# EAGLE design board (EAGLE 6.5.0)
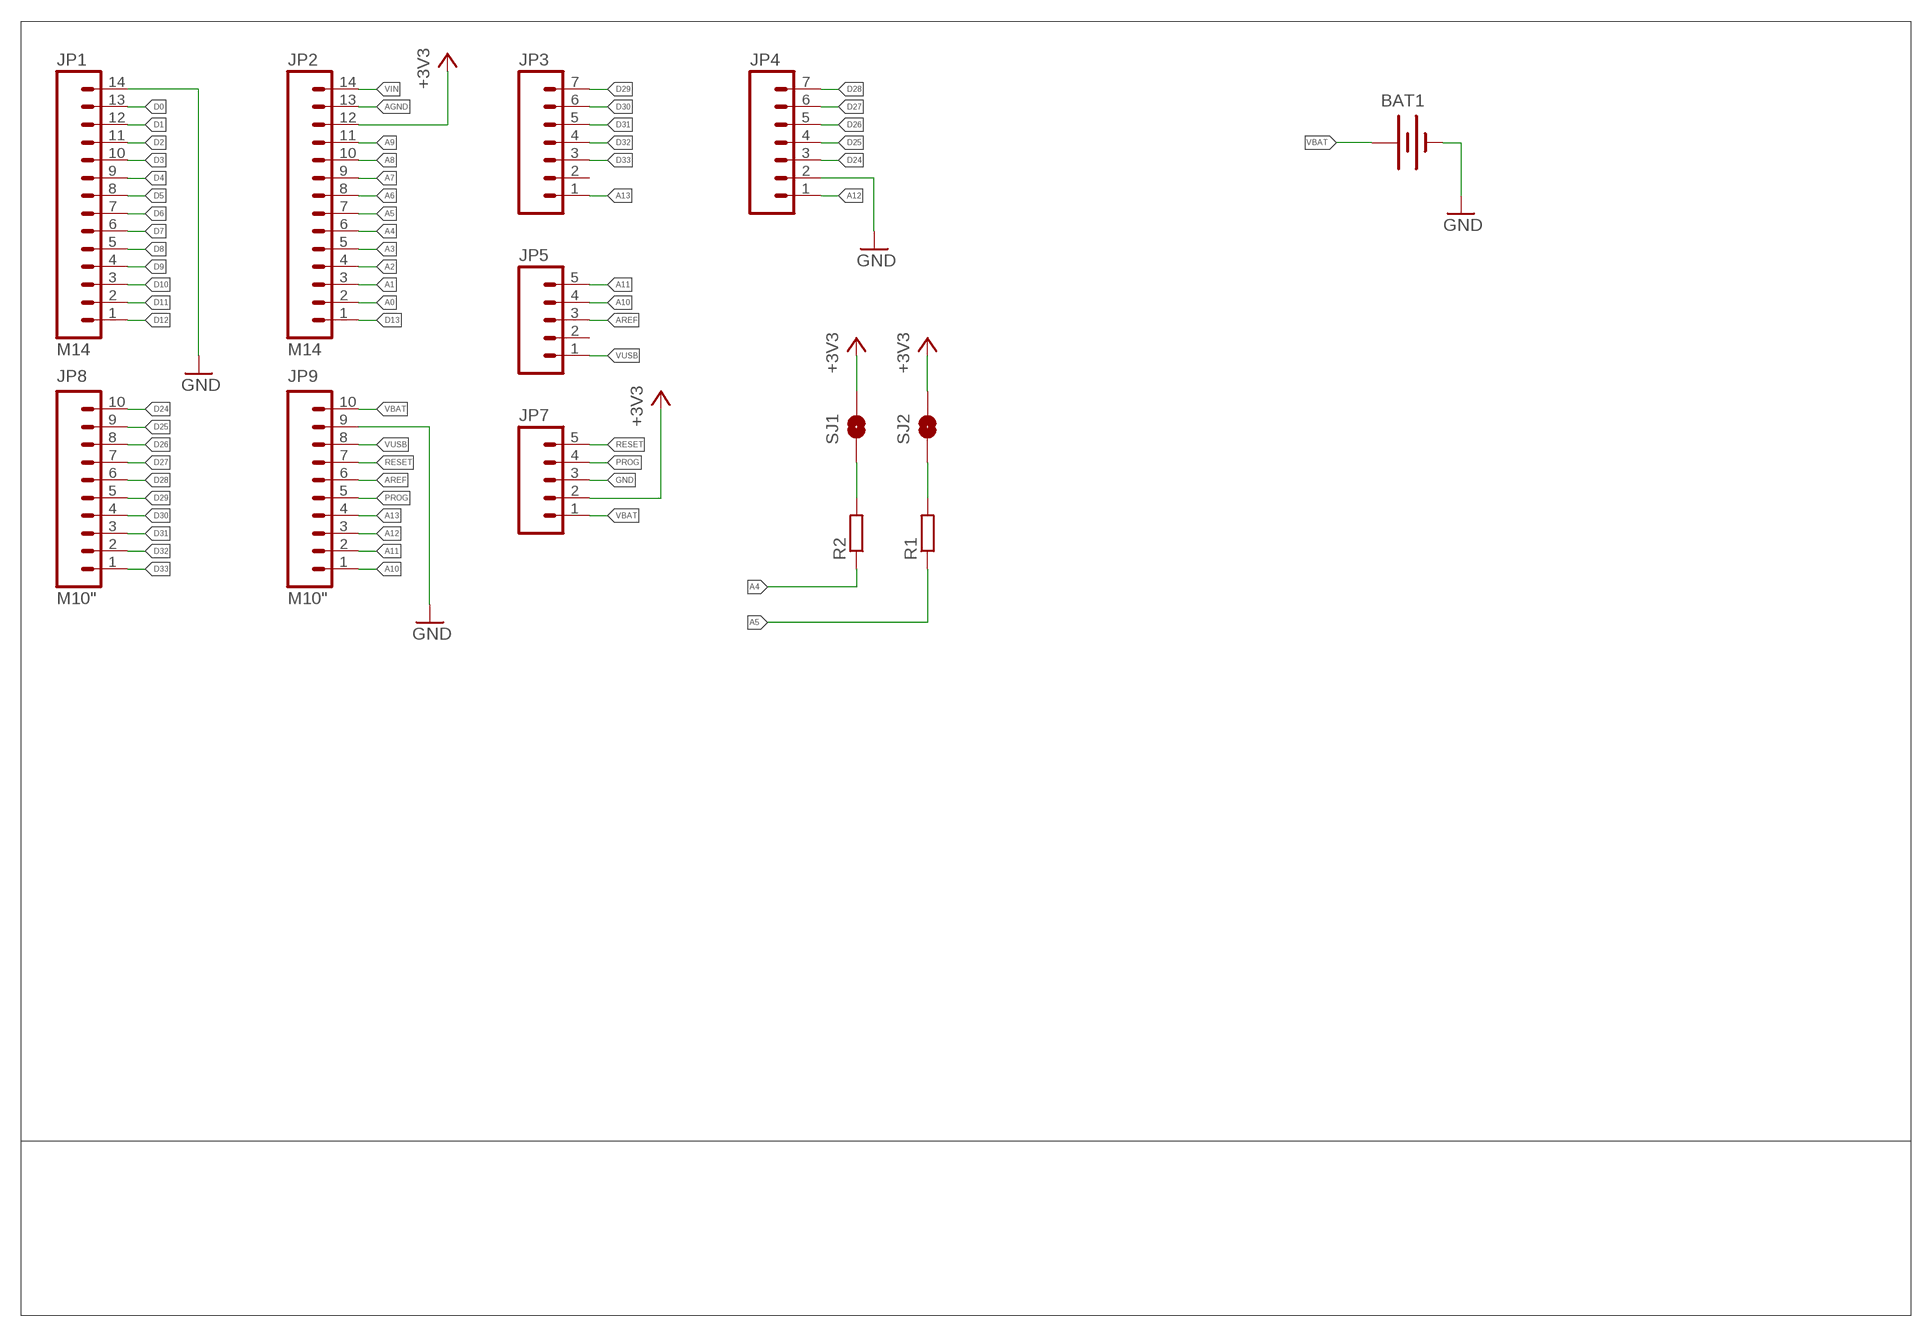
[diagram p0: schematic, sheet 1]

## Parts
BAT1  BATTERY12MM  [BATTCON_12MM]
JP1  M14  [1X14]
JP2  M14  [1X14]
JP3  M07  [1X07]
JP4  M07  [1X07]
JP5  M05PTH  [1X05]
JP7  M05PTH  [1X05]
JP8  M10"  [1X10]
JP9  M10"  [1X10]
R1  RESISTOR  [R0805]
R2  RESISTOR  [R0805]
SJ1  SOLDERJUMPERNO  [SJ_2S-NO]
SJ2  SOLDERJUMPERNO  [SJ_2S-NO]

## Nets
+3V3 [power]: JP2.12 JP7.2 SJ1.2 SJ2.2
A0: JP2.2
A1: JP2.3
A2: JP2.4
A3: JP2.5
A4: JP2.6 R2.1
A5: JP2.7 R1.1
A6: JP2.8
A7: JP2.9
A8: JP2.10
A9: JP2.11
A10: JP5.4 JP9.1
A11: JP5.5 JP9.2
A12: JP4.1 JP9.3
A13: JP3.1 JP9.4
AGND: JP2.13
AREF: JP5.3 JP9.6
D0: JP1.13
D1: JP1.12
D2: JP1.11
D3: JP1.10
D4: JP1.9
D5: JP1.8
D6: JP1.7
D7: JP1.6
D8: JP1.5
D9: JP1.4
D10: JP1.3
D11: JP1.2
D12: JP1.1
D13: JP2.1
D24: JP4.3 JP8.10
D25: JP4.4 JP8.9
D26: JP4.5 JP8.8
D27: JP4.6 JP8.7
D28: JP4.7 JP8.6
D29: JP3.7 JP8.5
D30: JP3.6 JP8.4
D31: JP3.5 JP8.3
D32: JP3.4 JP8.2
D33: JP3.3 JP8.1
GND [power]: BAT1.GND(-) JP1.14 JP4.2 JP7.3 JP9.9
N$2: R2.2 SJ1.1
N$3: R1.2 SJ2.1
PROG: JP7.4 JP9.5
RESET: JP7.5 JP9.7
VBAT: BAT1.PWR@1(+) JP7.1 JP9.10
VIN [power]: JP2.14
VUSB [power]: JP5.1 JP9.8
Unconnected: JP3.2 JP5.2

## Library data of the parts
BAT1 = SparkFun-Electromechanical:BATTERY: Battery Holders Various common sizes : AA, AAA, 20mm coin cell and 12mm coin cell. 20MM_4LEGS, BATT-10373
JP1 JP2 = SparkFun-Connectors:M14: Header 14 Standard 14-pin 0.1" header. Use with straight break away headers (SKU : PRT-00116), right angle break away headers (PRT-00553), swiss pins (PRT-00743), machine pins (PRT-00117), and female headers (PRT-00115).
JP3 JP4 = SparkFun-Connectors:M07: Header 7 Standard 7-pin 0.1" header. Use with straight break away headers (SKU : PRT-00116), right angle break away headers (PRT-00553), swiss pins (PRT-00743), machine pins (PRT-00117), and female headers (PRT-00115). NOTES ON THE VARIANTS LOCK and LOCK_LONGPADS... This footprint was designed to help hold the alignment of a through-hole component (i.e. 7-pin header) while soldering it into place. You may notice that each hole has been shifted either up or down by 0.005 of an inch from it's more standard position (which is usually a perfectly straight line). This slight alteration caused the pins (the squares in the middle) to touch the edges of the holes. Because they are alternating, it causes a "brace" to hold the header in place. 0.005 has proven to be the perfect amount of "off-center" position when using our standard breakaway headers. Although looks a little odd when you look at the bare footprint, once you have a header in there, the alteration is very hard to notice. Also, if you push a header all the way into place, it is covered up entirely on the bottom side. This idea of altering the position of holes to aid alignment will be further integrated into the Sparkfun Library for other footprints. It can help hold any component with 3 or more connection pins.
JP5 JP7 = SparkFun-Connectors:M05: Header 5 Standard 5-pin 0.1" header. Use with straight break away headers (SKU : PRT-00116), right angle break away headers (PRT-00553), swiss pins (PRT-00743), machine pins (PRT-00117), and female headers (PRT-00115). Molex polarized connector foot print use with SKU : PRT-08230 with associated crimp pins and housings.
JP8 JP9 = SparkFun-Connectors:M10: Header 10 Standard 10-pin 0.1" header. Use with straight break away headers (SKU : PRT-00116), right angle break away headers (PRT-00553), swiss pins (PRT-00743), machine pins (PRT-00117), and female headers (PRT-00115).
R1 R2 = thewknd:RESISTOR
SJ1 SJ2 = SparkFun-Passives:SOLDERJUMPER: Solder Jumper Standard SMD solder jumper. Used to automate production. Two varients : Normally Open and Normally Closed are the same, but have different paste layers. NC will have a large amount of paste and should jumper during reflow.

## Net classes
0 default: width 0.254 mm, drill 0.33 mm, clearance 0.203 mm
1 power: width 0.254 mm, drill 0.33 mm, clearance 0.203 mm

## Board
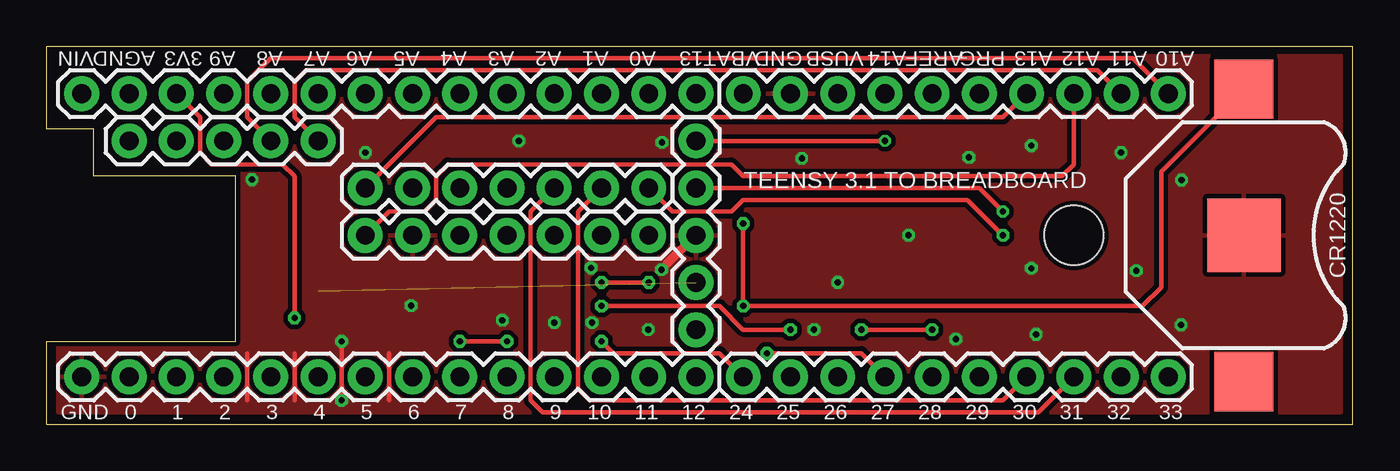
[diagram p1: board, top side]
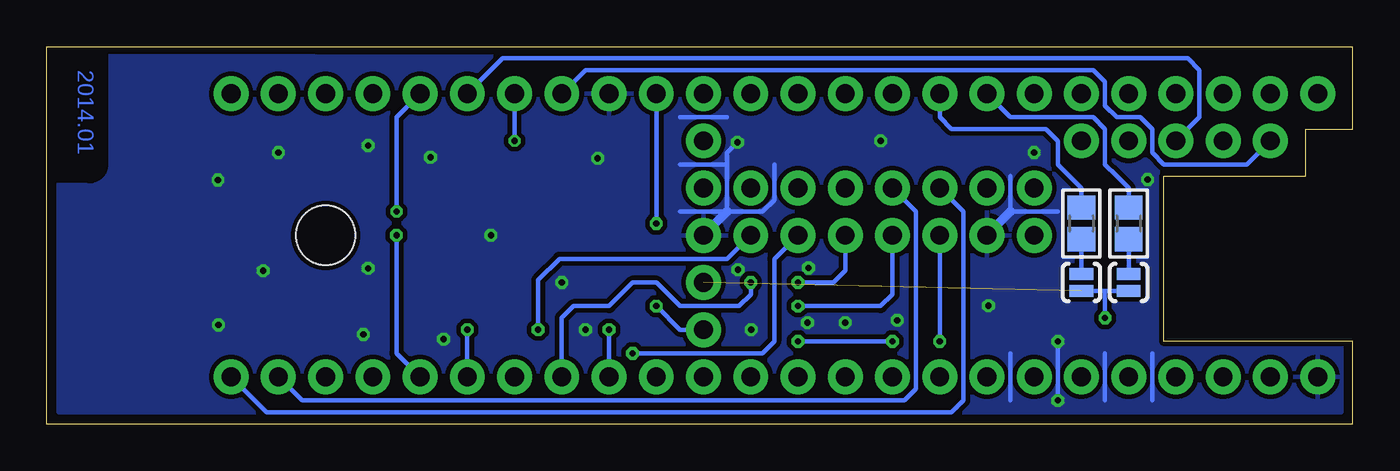
[diagram p2: board, bottom side, seen from below]

Size 70.25 x 20.32 mm. Coordinates in mm from the lower left corner, seen from the top.
Outline: 0,20.31 70.25,20.31 70.25,0 0,0 0,4.45 10.16,4.45 10.16,13.34 2.54,13.34 2.54,15.88 0,15.88 0,20.31
Outline: 0,20.31 0,20.32
Copper layers (1*16): Top 0.035mm / dielectric 1.5mm / Bottom 0.035mm
Design rules "Fusion_seeedstudio_rule_v1.1": minimum track width 6mil, minimum drill 12mil, track to track 6mil, track to pad 6mil, pad to pad 6mil, via to via 6mil, smd to smd 0mil, copper to edge 10mil, drill to drill 10mil, minimum pad ring 10mil, minimum via ring 6mil, stop-mask expansion 2mil, vias tented up to drill 100mil, thermal gap 10mil
Holes 3.2 mm at 55.24,10.16
bRestrict: 3 lines

### Footprints (pad centres in the part's own frame; a part is rotated, then mirrored left to right if it is on the bottom)
BATTCON_12MM = smd 3.962 x 3.962: GND 0,0 | smd 3.175 x 3.175: PWR@1 -7.874,0; PWR@2 7.874,0
1X14 = drill 1.016 pad 1.88: 1 0,0; 2 2.54,0; 3 5.08,0; 4 7.62,0; 5 10.16,0; 6 12.7,0; 7 15.24,0; 8 17.78,0; 9 20.32,0; 10 22.86,0; 11 25.4,0; 12 27.94,0; 13 30.48,0; 14 33.02,0
1X07 = drill 1.016 pad 1.88: 1 0,0; 2 2.54,0; 3 5.08,0; 4 7.62,0; 5 10.16,0; 6 12.7,0; 7 15.24,0
1X05 = drill 1.016 pad 1.88: 1 0,0; 2 2.54,0; 3 5.08,0; 4 7.62,0; 5 10.16,0
1X10 = drill 1.016 pad 1.88: 1 0,0; 2 2.54,0; 3 5.08,0; 4 7.62,0; 5 10.16,0; 6 12.7,0; 7 15.24,0; 8 17.78,0; 9 20.32,0; 10 22.86,0
R0805 = smd 1.3 x 1.5: 1 -0.85,0; 2 0.85,0
SJ_2S-NO = smd 0.635 x 1.27: 1 -0.45,0; 2 0.45,0

### Placement (x,y rotation side)
BAT1  64.39,10.16 270 top
JP1  34.92,2.54 180 top
JP2  34.92,17.78 180 top
JP3  17.14,12.7 0 top
JP4  17.14,10.16 0 top
JP5  4.45,15.24 0 top
JP7  34.92,5.08 90 top
JP8  60.33,2.54 180 top
JP9  60.33,17.78 180 top
R1  12.06,10.79 270 bottom
R2  14.61,10.79 270 bottom
SJ1  14.61,7.62 270 bottom
SJ2  12.06,7.62 270 bottom

### Tracks (layer width: path | path; a pad name or v marks a point on that pad's centre or on a via)
+3V3  (via drill 0.33 pad 0.69)  (1 unrouted)
  Top 0.254: JP2.12 8.26,16.51 8.26,14.61 8.89,13.97 10.16,13.97 12.7,13.97 13.34,13.34 v13.34,5.71
  Bottom 0.254: SJ1.2 13.34,7.17 | 13.34,7.17 SJ2.2 | v13.34,5.71 13.34,7.17
A4
  Bottom 0.254: R2.1 14.61,12.7 15.88,13.97 15.88,15.24 16.51,15.88 21.59,15.88 22.23,16.51 JP2.6
A5
  Bottom 0.254: R1.1 12.06,12.7 12.7,13.34 13.34,13.97 13.34,15.88 13.97,16.51 18.41,16.51 JP2.7
A10
  Top 0.254: JP9.1 58.42,19.68 12.06,19.68 10.79,18.41 10.79,16.51 JP5.4
A11
  Top 0.254: JP9.2 56.52,19.05 13.97,19.05 13.34,18.41 13.34,16.51 JP5.5
A12
  Top 0.254: JP9.3 55.24,13.97 54.61,13.34 50.16,13.34 49.53,13.34 37.47,13.34 36.83,13.97 21.59,13.97 20.95,13.34 20.95,12.06 20.32,11.43 18.41,11.43 JP4.1
A13
  Top 0.254: JP9.4 51.44,16.51 20.95,16.51 JP3.1
AREF
  Bottom 0.254: JP9.6 45.72,19.68 11.43,19.68 8.89,19.68 8.26,19.05 8.26,16.51 JP5.3
D24  (via drill 0.33 pad 0.69)
  Top 0.254: JP8.10 36.2,3.81 30.48,3.81 v29.84,4.45 | v22.23,4.45 v24.77,4.45
  Bottom 0.254: JP4.3 v22.23,4.45 | v24.77,4.45 v29.84,4.45
D25  (via drill 0.33 pad 0.69)
  Top 0.254: v29.84,6.35 36.2,6.35 37.47,5.08 v40.01,5.08
  Bottom 0.254: JP4.4 24.77,6.99 25.4,6.35 v29.84,6.35 | v40.01,5.08 JP8.9
D26  (via drill 0.33 pad 0.69)
  Top 0.254: v29.84,7.62 v32.38,7.62
  Bottom 0.254: JP4.5 27.3,8.26 27.94,7.62 v29.84,7.62 | v32.38,7.62 32.38,6.99 33.02,6.35 36.2,6.35 37.47,7.62 38.73,7.62 40.01,6.35 41.91,6.35 42.55,5.71 JP8.8
D27  (via drill 0.33 pad 0.69)
  Top 0.254: v38.73,3.81 43.81,3.81 JP8.7
  Bottom 0.254: JP4.6 31.11,8.89 31.11,4.45 31.75,3.81 v38.73,3.81
D28  (via drill 0.33 pad 0.69)
  Top 0.254: v43.81,5.08 v47.62,5.08
  Bottom 0.254: JP4.7 33.66,8.89 35.56,8.89 37.47,8.89 42.67,8.89 43.81,7.75 v43.81,5.08 | v47.62,5.08 JP8.6
D29  (via drill 0.33 pad 0.69)
  Top 0.254: JP3.7 33.66,11.43 36.83,11.43 37.47,12.06 49.53,12.06 v51.44,10.16
  Bottom 0.254: v51.44,10.16 51.44,3.81 JP8.5
D30
  Top 0.254: JP8.4 51.44,1.27 29.21,1.27 28.57,1.91 28.57,11.43 JP3.6
D31
  Top 0.254: JP8.3 53.34,0.64 26.67,0.64 26.04,1.27 26.04,11.43 JP3.5
D32
  Bottom 0.254: JP8.2 56.52,1.27 24.13,1.27 23.5,1.91 23.5,11.43 JP3.4
D33
  Bottom 0.254: JP8.1 58.42,0.64 21.59,0.64 20.95,1.27 20.95,11.43 JP3.3
GND  (via drill 0.33 pad 0.69)
  Top 0.254: v15.88,1.27 v15.88,4.45 | 13.34,3.81 13.34,1.27 | 10.79,3.81 10.79,1.27 | 18.41,3.81 18.41,1.27
  Top 0.508: JP7.3 34.9,10.16 33.4,8.66
  Bottom 0.254: 33.66,11.43 33.66,13.97 | 33.66,13.97 33.66,14.61 v33.1,15.16 | v15.88,1.27 v15.88,4.45 | 31.11,13.97 31.11,12.06 31.75,11.43 33.66,11.43 | 33.66,11.43 36.2,11.43 | 33.66,13.97 36.2,13.97 | 10.79,1.27 10.79,3.81 | 13.34,1.27 13.34,3.81 | 18.41,1.27 18.41,3.81 | 18.41,13.34 18.41,11.43 15.88,11.43 | 33.66,16.51 36.2,16.51
  Bottom 0.508: JP7.3 33.66,11.43 | JP4.2 18.41,11.43
  other vias: 24.51,5.59 17.14,14.61 25.4,15.24 41.27,5.08 48.9,4.57 46.35,10.16 27.3,5.46 29.34,5.46 42.55,7.62 61.01,5.33 61.04,13.13 11.05,13.16 32.36,5.08 33.07,8.31 29.29,8.41 19.61,6.38 57.78,14.61 58.6,8.26 53.21,4.83 49.61,14.35 40.61,14.3 52.96,8.38 52.96,14.99
  pour Top (isolate 0.254, rank 2): 0.64,0.64 69.6,0.64 69.6,19.81 0.64,19.68
  pour Bottom (isolate 0.254, rank 2): 0.64,19.68 0.64,0.64 69.6,0.64 69.6,19.81
N$2
  Bottom 0.254: R2.2 SJ1.1
N$3
  Bottom 0.254: R1.2 SJ2.1
PROG  (via drill 0.33)
  Top 0.254: v51.44,11.43 50.16,12.7 JP7.4
  Bottom 0.254: v51.44,11.43 51.44,16.51 JP9.5
RESET  (via drill 0.33)
  Top 0.254: JP7.5 v45.09,15.24
  Bottom 0.254: v45.09,15.24 JP9.7
VBAT  (via drill 0.33 pad 0.69)
  Top 0.254: v37.47,10.79 v37.47,6.35 58.29,6.35 58.93,6.35 59.94,7.37 59.94,13.59 BAT1.PWR@1 63.75,18.03
  Bottom 0.254: JP7.1 36.2,5.08 v37.47,6.35 | JP9.10 v37.47,10.79
VUSB
  Bottom 0.254: JP9.8 41.27,19.05 13.97,19.05 13.34,18.41 13.34,17.14 12.7,16.51 11.43,16.51 10.79,15.88 10.79,14.61 10.16,13.97 5.71,13.97 JP5.1

### Text on the board
Bottom: 2014.01
tPlace: TEENSY 3.1 TO BREADBOARD | CR1220
tNames: VIN | AGND | 3V3 | A9 | A8 | A7 | A6 | A5 | A4 | A3 | A2 | A1 | A0 | 13 | VBAT | GND | VUSB | A14 | AREF | PRG | A13 | A12 | A11 | A10 | GND | 0 | 1 | 2 | 3 | 4 | 5 | 6 | 7 | 8 | 9 | 10 | 11 | 12 | 24 | 25 | 26 | 27 | 28 | 29 | 30 | 31 | 32 | 33